# EAGLE schematic tottag (EAGLE 9.4.2)
AUTHOR: Andreas Biri; REV: F; TITLE: TotTag

## Sheet 1 of 4: nRF8240
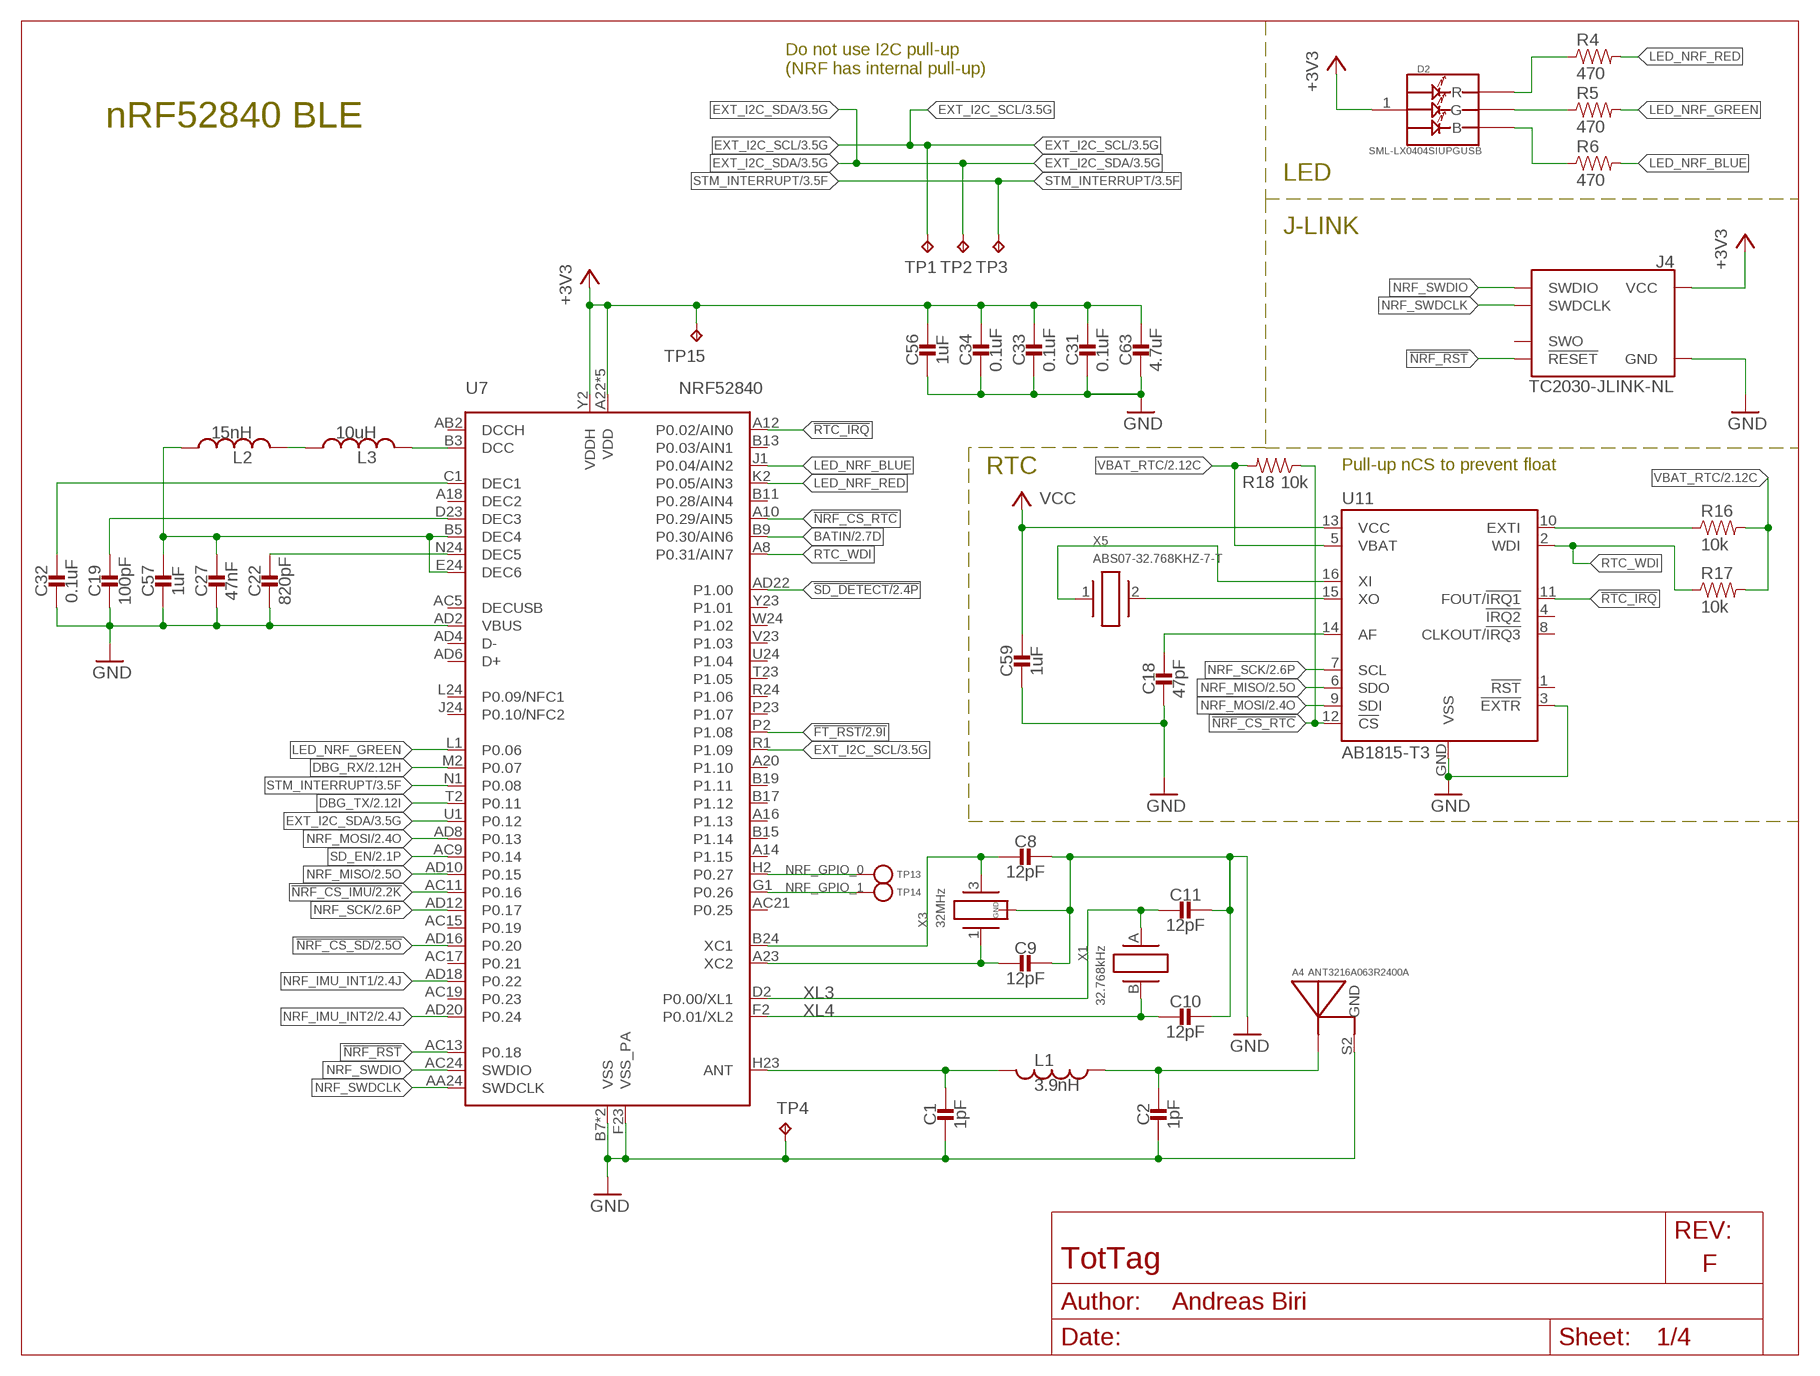
[diagram p0: schematic, sheet 1]

### Parts
A4  ANT3216A063R2400A  [ANT3216A063R2400A]
C1  1pF  CAPACITOR0402_CAP  [0402_CAP]
C2  1pF  CAPACITOR0402_CAP  [0402_CAP]
C8  12pF  CAPACITOR0402_CAP  [0402_CAP]
C9  12pF  CAPACITOR0402_CAP  [0402_CAP]
C10  12pF  CAPACITOR0402_CAP  [0402_CAP]
C11  12pF  CAPACITOR0402_CAP  [0402_CAP]
C18  47pF  CAPACITOR0402_CAP  [0402_CAP]
C19  100pF  CAPACITOR0402_CAP  [0402_CAP]
C22  820pF  CAPACITOR0402_CAP  [0402_CAP]
C27  47nF  CAPACITOR0402_CAP  [0402_CAP]
C31  0.1uF  CAPACITOR0402_CAP  [0402_CAP]
C32  0.1uF  CAPACITOR0402_CAP  [0402_CAP]
C33  0.1uF  CAPACITOR0402_CAP  [0402_CAP]
C34  0.1uF  CAPACITOR0402_CAP  [0402_CAP]
C56  1uF  CAPACITOR0402_CAP  [0402_CAP]
C57  1uF  CAPACITOR0402_CAP  [0402_CAP]
C59  1uF  CAPACITOR0402_CAP  [0402_CAP]
C63  4.7uF  CAPACITOR0402_CAP  [0402_CAP]
D2  SML-LX0404SIUPGUSB  [1MM_SQ_4PAD]
J4  TC2030-JLINK-NL  [TC2030-IDC-NL]
L1  3.9nH  INDUCTOR0402  [0402_CAP]
L2  15nH  INDUCTOR0402  [0402_CAP]
L3  10uH  INDUCTOR0603  [0603_CAP]
R4  470  RESISTOR0402_RES  [0402_RES]
R5  470  RESISTOR0402_RES  [0402_RES]
R6  470  RESISTOR0402_RES  [0402_RES]
R16  10k  RESISTOR0402_RES  [0402_RES]
R17  10k  RESISTOR0402_RES  [0402_RES]
R18  10k  RESISTOR0402_RES  [0402_RES]
TP1  TPTP06SQ  [TP06SQ]
TP2  TPTP06SQ  [TP06SQ]
TP3  TPTP06SQ  [TP06SQ]
TP4  TPTP06SQ  [TP06SQ]
TP13  TEST-POINT  [PAD.03X.03]
TP14  TEST-POINT  [PAD.03X.03]
TP15  TPTP06SQ  [TP06SQ]
U7  NRF52840  [AQFN73]
U11  AB1815-T3  [QFN-16-3MM]
X1  32.768kHz  ABS05-32.768KHZ-9-T  [ABS05]
X3  32MHz  7V-32.000MAHV-T  [TXC-7V]
X5  ABS07-32.768KHZ-7-T  [2-SMD]

### Nets
!FT_RST: U7.P2(P1.08) ; also sheet 2
!NRF_CS_IMU: U7.AC11(P0.16) ; also sheet 2
!NRF_CS_RTC: R18.1 U7.A10(P0.29/AIN5) U11.12(!CS)
!NRF_CS_SD: U7.AD16(P0.20) ; also sheet 2
!NRF_RST: J4.3(!RESET) U7.AC13(P0.18)
!RTC_IRQ: U7.A12(P0.02/AIN0) U11.11(FOUT/!IRQ1)
!SD_DETECT: U7.AD22(P1.00) ; also sheet 2
+3V3: C31.1 C33.1 C34.1 C56.1 C63.1 D2.1(VDD) J4.1(VCC) TP15.TP U7.A22(VDD) U7.AD14(VDD) U7.AD23(VDD) U7.B1(VDD) U7.W1(VDD) U7.Y2(VDDH) ; also sheet 2,3,4
BATIN: U7.B9(P0.30/AIN6) ; also sheet 2
DBG_RX: U7.M2(P0.07) ; also sheet 2
DBG_TX: U7.T2(P0.11) ; also sheet 2
EXT_I2C_SCL: TP1.TP U7.R1(P1.09) ; also sheet 3,4
EXT_I2C_SDA: TP2.TP U7.U1(P0.12) ; also sheet 3,4
GND: A4.S2(GND) C1.2 C2.2 C8.1 C9.1 C10.1 C11.1 C18.2 C19.2 C22.2 C27.2 C31.2 C32.2 C33.2 C34.2 C56.2 C57.2 C59.2 C63.2 J4.5(GND) TP4.TP U7.AD2(VBUS) U7.B7(VSS) U7.F23(VSS_PA) U7.GND(VSS) U11.3(!EXTR) U11.GND(VSS) X3.2(GND) X3.4(GND) ; also sheet 2,3
LED_NRF_BLUE: R6.2 U7.J1(P0.04/AIN2)
LED_NRF_GREEN: R5.2 U7.L1(P0.06)
LED_NRF_RED: R4.2 U7.K2(P0.05/AIN3)
N$2: C22.1 U7.N24(DEC5)
N$6: C32.1 U7.C1(DEC1)
N$9: C27.1 C57.1 L2.1 U7.B5(DEC4) U7.E24(DEC6)
N$10: C19.1 U7.D23(DEC3)
N$15: C1.1 L1.2 U7.H23(ANT)
N$17: A4.S1(ANTENNA) C2.1 L1.1
N$18: C8.2 U7.B24(XC1) X3.3
N$19: C9.2 U7.A23(XC2) X3.1
N$20: L3.2 U7.B3(DCC)
N$35: C18.1 U11.14(AF)
N$37: L2.2 L3.1
N$41: U11.16(XI) X5.1
N$42: U11.15(XO) X5.2
N$43: R16.1 U11.10(EXTI)
N$59: D2.2(R) R4.1
N$60: D2.4(G) R5.1
N$61: D2.3(B) R6.1
NRF_GPIO_0: TP13.P$1(TESTPOINT) U7.H2(P0.27)
NRF_GPIO_1: TP14.P$1(TESTPOINT) U7.G1(P0.26)
NRF_IMU_INT1: U7.AD18(P0.22) ; also sheet 2
NRF_IMU_INT2: U7.AD20(P0.24) ; also sheet 2
NRF_MISO: U7.AD10(P0.15) U11.6(SDO) ; also sheet 2
NRF_MOSI: U7.AD8(P0.13) U11.9(SDI) ; also sheet 2
NRF_SCK: U7.AD12(P0.17) U11.7(SCL) ; also sheet 2
NRF_SWDCLK: J4.4(SWDCLK) U7.AA24(SWDCLK)
NRF_SWDIO: J4.2(SWDIO) U7.AC24(SWDIO)
RTC_WDI: R17.1 U7.A8(P0.31/AIN7) U11.2(WDI)
SD_EN: U7.AC9(P0.14) ; also sheet 2
STM_INTERRUPT: TP3.TP U7.N1(P0.08) ; also sheet 3,4
VBAT_RTC: R16.2 R17.2 R18.2 U11.5(VBAT) ; also sheet 2
VCC: C59.1 U11.13(VCC)
XL3: C11.2 U7.D2(P0.00/XL1) X1.A
XL4: C10.2 U7.F2(P0.01/XL2) X1.B
Unconnected: J4.6(SWO) U7.A14(P1.15) U7.A16(P1.13) U7.A18(DEC2) U7.A20(P1.10) U7.AB2(DCCH) U7.AC5(DECUSB) U7.AC15(P0.19) U7.AC17(P0.21) U7.AC19(P0.23) U7.AC21(P0.25) U7.AD4(D-) U7.AD6(D+) U7.B11(P0.28/AIN4) U7.B13(P0.03/AIN1) U7.B15(P1.14) U7.B17(P1.12) U7.B19(P1.11) U7.J24(P0.10/NFC2) U7.L24(P0.09/NFC1) U7.P23(P1.07) U7.R24(P1.06) U7.T23(P1.05) U7.U24(P1.04) U7.V23(P1.03) U7.W24(P1.02) U7.Y23(P1.01) U11.1(!RST) U11.4(!IRQ2) U11.8(CLKOUT/!IRQ3)

### Notes on the sheet
- Do not use I2C pull-up
  (NRF has internal pull-up)
- nRF52840 BLE
- LED
- J-LINK
- RTC | Pull-up nCS to prevent float

## Sheet 2 of 4: Power + SD + Sensors
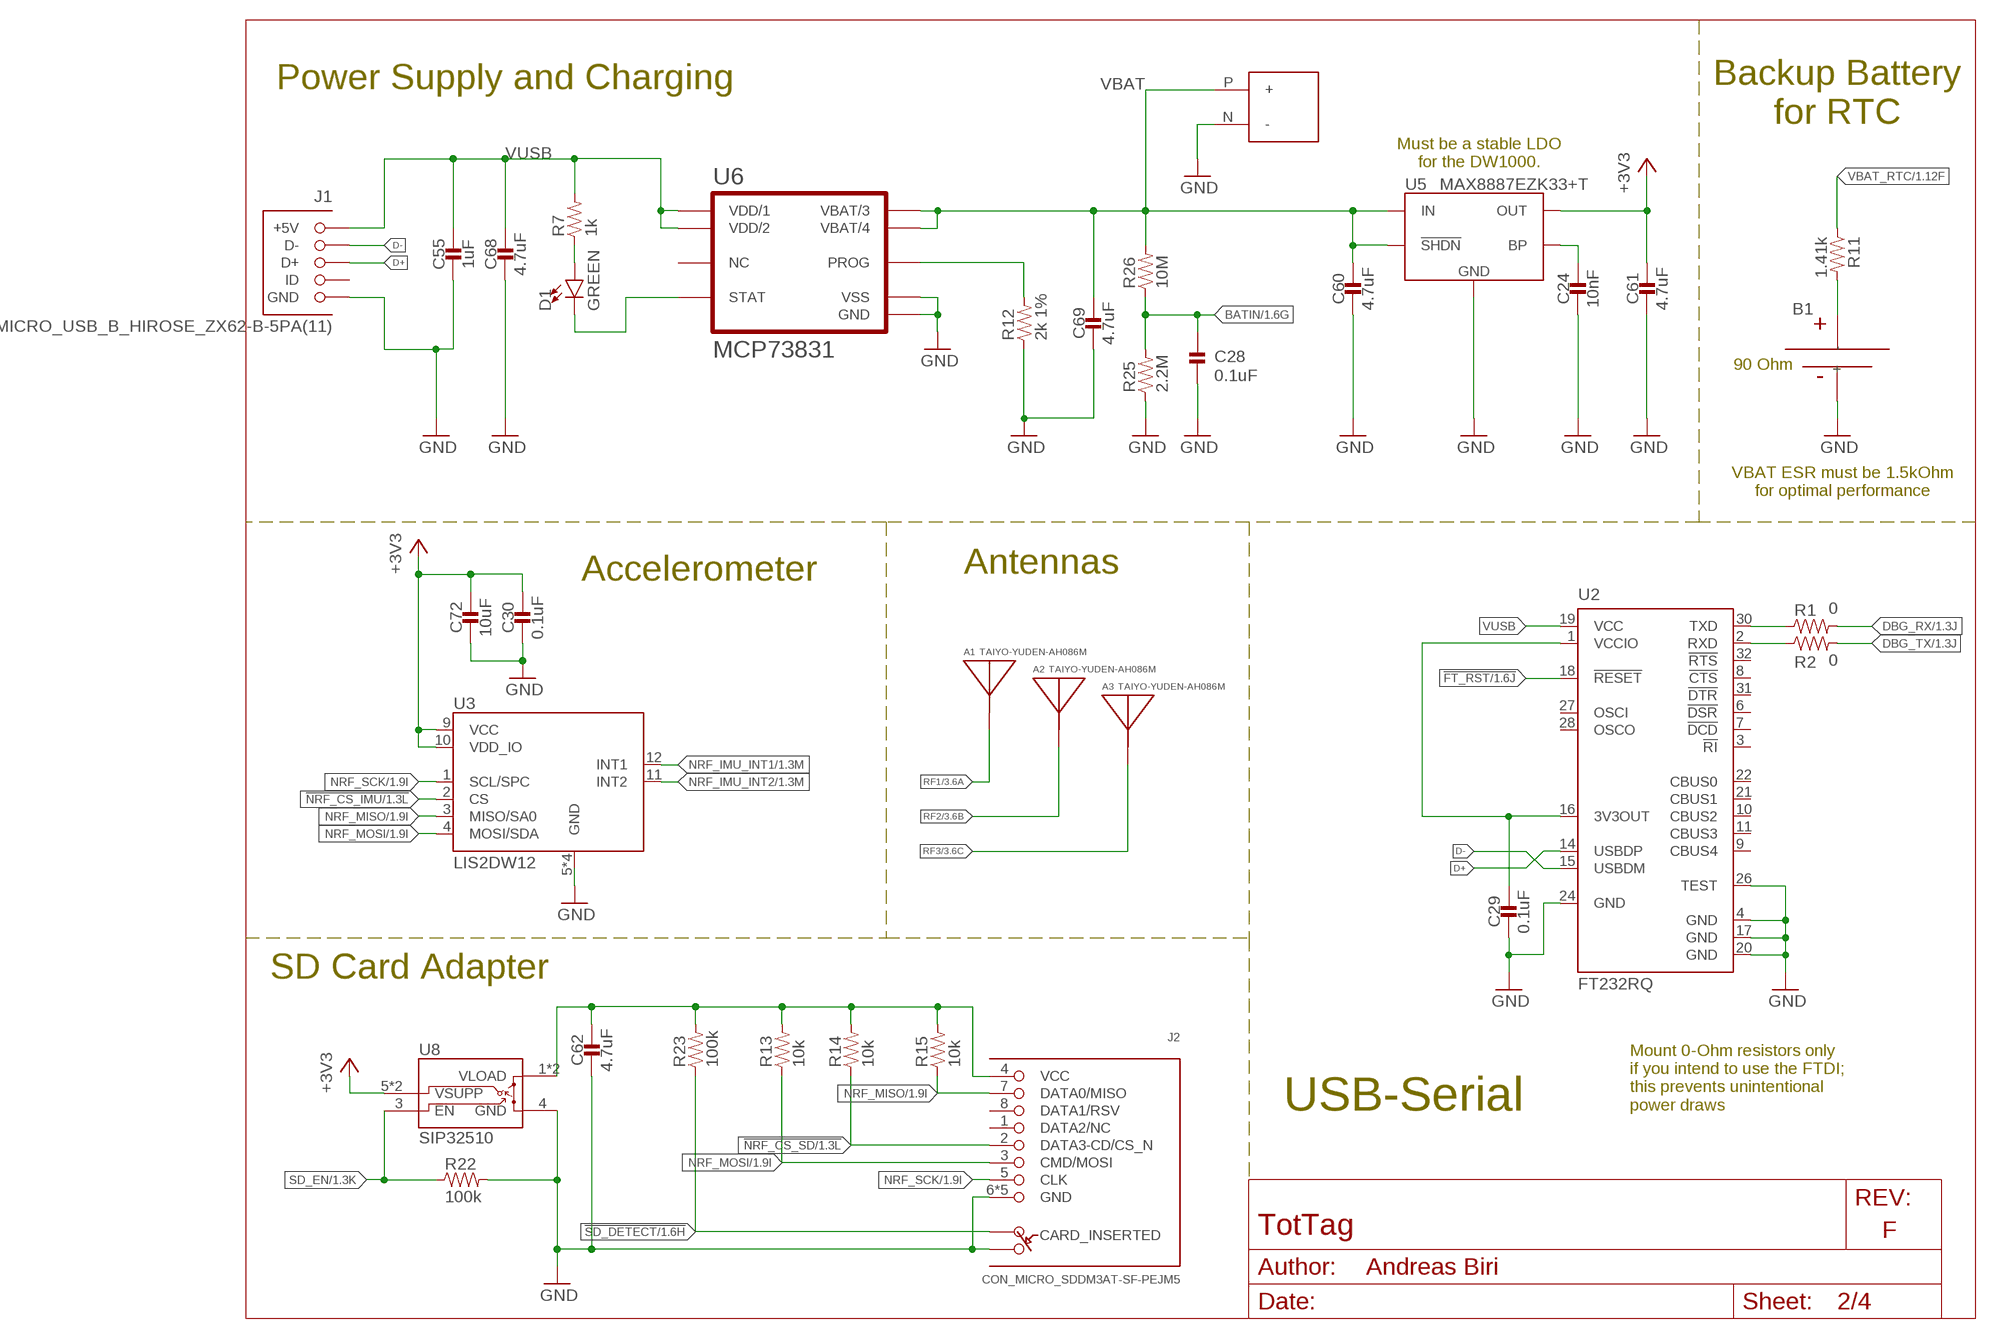
[diagram p1: schematic, sheet 2]

### Parts
A1  TAIYO-YUDEN-AH086M  [TAIYO-YUDEN-AH086M]
A2  TAIYO-YUDEN-AH086M  [TAIYO-YUDEN-AH086M]
A3  TAIYO-YUDEN-AH086M  [TAIYO-YUDEN-AH086M]
B1  MS518SE  [MS518SE-FL35E]
C24  10nF  CAPACITOR0402_CAP  [0402_CAP]
C28  0.1uF  CAPACITOR0402_CAP  [0402_CAP]
C29  0.1uF  CAPACITOR0402_CAP  [0402_CAP]
C30  0.1uF  CAPACITOR0402_CAP  [0402_CAP]
C55  1uF  CAPACITOR0402_CAP  [0402_CAP]
C60  4.7uF  CAPACITOR0402_CAP  [0402_CAP]
C61  4.7uF  CAPACITOR0402_CAP  [0402_CAP]
C62  4.7uF  CAPACITOR0402_CAP  [0402_CAP]
C68  4.7uF  CAPACITOR0402_CAP  [0402_CAP]
C69  4.7uF  CAPACITOR0402_CAP  [0402_CAP]
C72  10uF  CAPACITOR0603_CAP  [0603_CAP]
D1  GREEN  LED0603  [LED-0603]
J1  MICRO_USB_B_HIROSE_ZX62-B-5PA(11)  [USB_MICRO_B-HIROSE-ZX62-B-5PA(11)]
J2  CON_MICRO_SDDM3AT-SF-PEJM5  [DM3AT-SF-PEJM5]
J3  BAT_HOLE  [BATTERY_HOLE]
R1  0  RESISTOR0402_RES  [0402_RES]
R2  0  RESISTOR0402_RES  [0402_RES]
R7  1k  RESISTOR0402_RES  [0402_RES]
R11  1.41k  RESISTOR0402_RES  [0402_RES]
R12  2k 1%  RESISTOR0402_RES  [0402_RES]
R13  10k  RESISTOR0402_RES  [0402_RES]
R14  10k  RESISTOR0402_RES  [0402_RES]
R15  10k  RESISTOR0402_RES  [0402_RES]
R22  100k  RESISTOR0402_RES  [0402_RES]
R23  100k  RESISTOR0402_RES  [0402_RES]
R25  2.2M  RESISTOR0402_RES  [0402_RES]
R26  10M  RESISTOR0402_RES  [0402_RES]
U2  FT232RQ  [QFN32]
U3  LIS2DW12  [LGA-12]
U5  MAX8887EZK33+T  [SOT-23-5]
U6  MCP73831  [DFN-8-MCP]
U8  SIP32510  [TSOT23-6]

### Nets
!CHRG: D1.A R7.1
!FT_RST: U2.18(!RESET) ; also sheet 1
!NRF_CS_IMU: U3.2(CS) ; also sheet 1
!NRF_CS_SD: J2.2(DATA3-CD/CS_N) R14.1 ; also sheet 1
!SD_DETECT: J2.A R23.1 ; also sheet 1
+3V3: C30.1 C61.1 C72.1 U3.9(VCC) U3.10(VDD_IO) U5.5(OUT) U8.5(VSUPP) U8.6(VSUPP) ; also sheet 1,3,4
BATIN: C28.2 R25.2 R26.1 ; also sheet 1
D+: J1.3(D+) U2.14(USBDP)
D-: J1.2(D-) U2.15(USBDM)
DBG_RX: R1.2 ; also sheet 1
DBG_TX: R2.2 ; also sheet 1
GND: B1.- C24.2 C28.1 C29.2 C30.2 C55.2 C60.2 C61.2 C62.2 C68.2 C69.2 C72.2 J1.5(GND) J2.6(GND) J2.B J2.MOUNT0(GND) J2.MOUNT1(GND) J2.MOUNT2(GND) J2.MOUNT3(GND) J3.N(-) R12.1 R22.2 R25.1 U2.4(GND) U2.17(GND) U2.20(GND) U2.24(GND) U2.26(TEST) U3.5(GND) U3.6(GND) U3.7(GND) U3.8(GND) U5.2(GND) U6.6(VSS) U6.GND U8.4(GND) ; also sheet 1,3
N$1: C29.1 U2.1(VCCIO) U2.16(3V3OUT)
N$5: D1.C U6.5(STAT)
N$11: C24.1 U5.4(BP)
N$13: R12.2 U6.8(PROG)
N$33: R1.1 U2.30(TXD)
N$34: R2.1 U2.2(RXD)
N$45: B1.+ R11.2
N$55: C62.1 J2.4(VCC) R13.2 R14.2 R15.2 R23.2 U8.1(VLOAD) U8.2(VLOAD)
NRF_IMU_INT1: U3.12(INT1) ; also sheet 1
NRF_IMU_INT2: U3.11(INT2) ; also sheet 1
NRF_MISO: J2.7(DATA0/MISO) R15.1 U3.3(MISO/SA0) ; also sheet 1
NRF_MOSI: J2.3(CMD/MOSI) R13.1 U3.4(MOSI/SDA) ; also sheet 1
NRF_SCK: J2.5(CLK) U3.1(SCL/SPC) ; also sheet 1
RF1: A1.A(ANTENNA) ; also sheet 3,4
RF2: A2.A(ANTENNA) ; also sheet 3,4
RF3: A3.A(ANTENNA) ; also sheet 3,4
SD_EN: R22.1 U8.3(EN) ; also sheet 1
VBAT: C60.1 C69.1 J3.P(+) R26.2 U5.1(IN) U5.3(!SHDN) U6.3(VBAT/3) U6.4(VBAT/4)
VBAT_RTC: R11.1 ; also sheet 1
VUSB: C55.1 C68.1 J1.1(+5V) R7.2 U2.19(VCC) U6.1(VDD/1) U6.2(VDD/2)
Unconnected: J1.4(ID) J2.1(DATA2/NC) J2.8(DATA1/RSV) U2.3(!RI) U2.6(!DSR) U2.7(!DCD) U2.8(!CTS) U2.9(CBUS4) U2.10(CBUS2) U2.11(CBUS3) U2.21(CBUS1) U2.22(CBUS0) U2.27(OSCI) U2.28(OSCO) U2.31(!DTR) U2.32(!RTS) U6.7(NC)

### Notes on the sheet
- Power Supply and Charging
- Backup Battery
  for RTC
- Must be a stable LDO
  for the DW1000.
- 90 Ohm
- VBAT ESR must be 1.5kOhm
  for optimal performance
- Accelerometer | Antennas
- SD Card Adapter
- USB-Serial
- Mount 0-Ohm resistors only
  if you intend to use the FTDI;
  this prevents unintentional
  power draws

## Sheet 3 of 4: Localization module
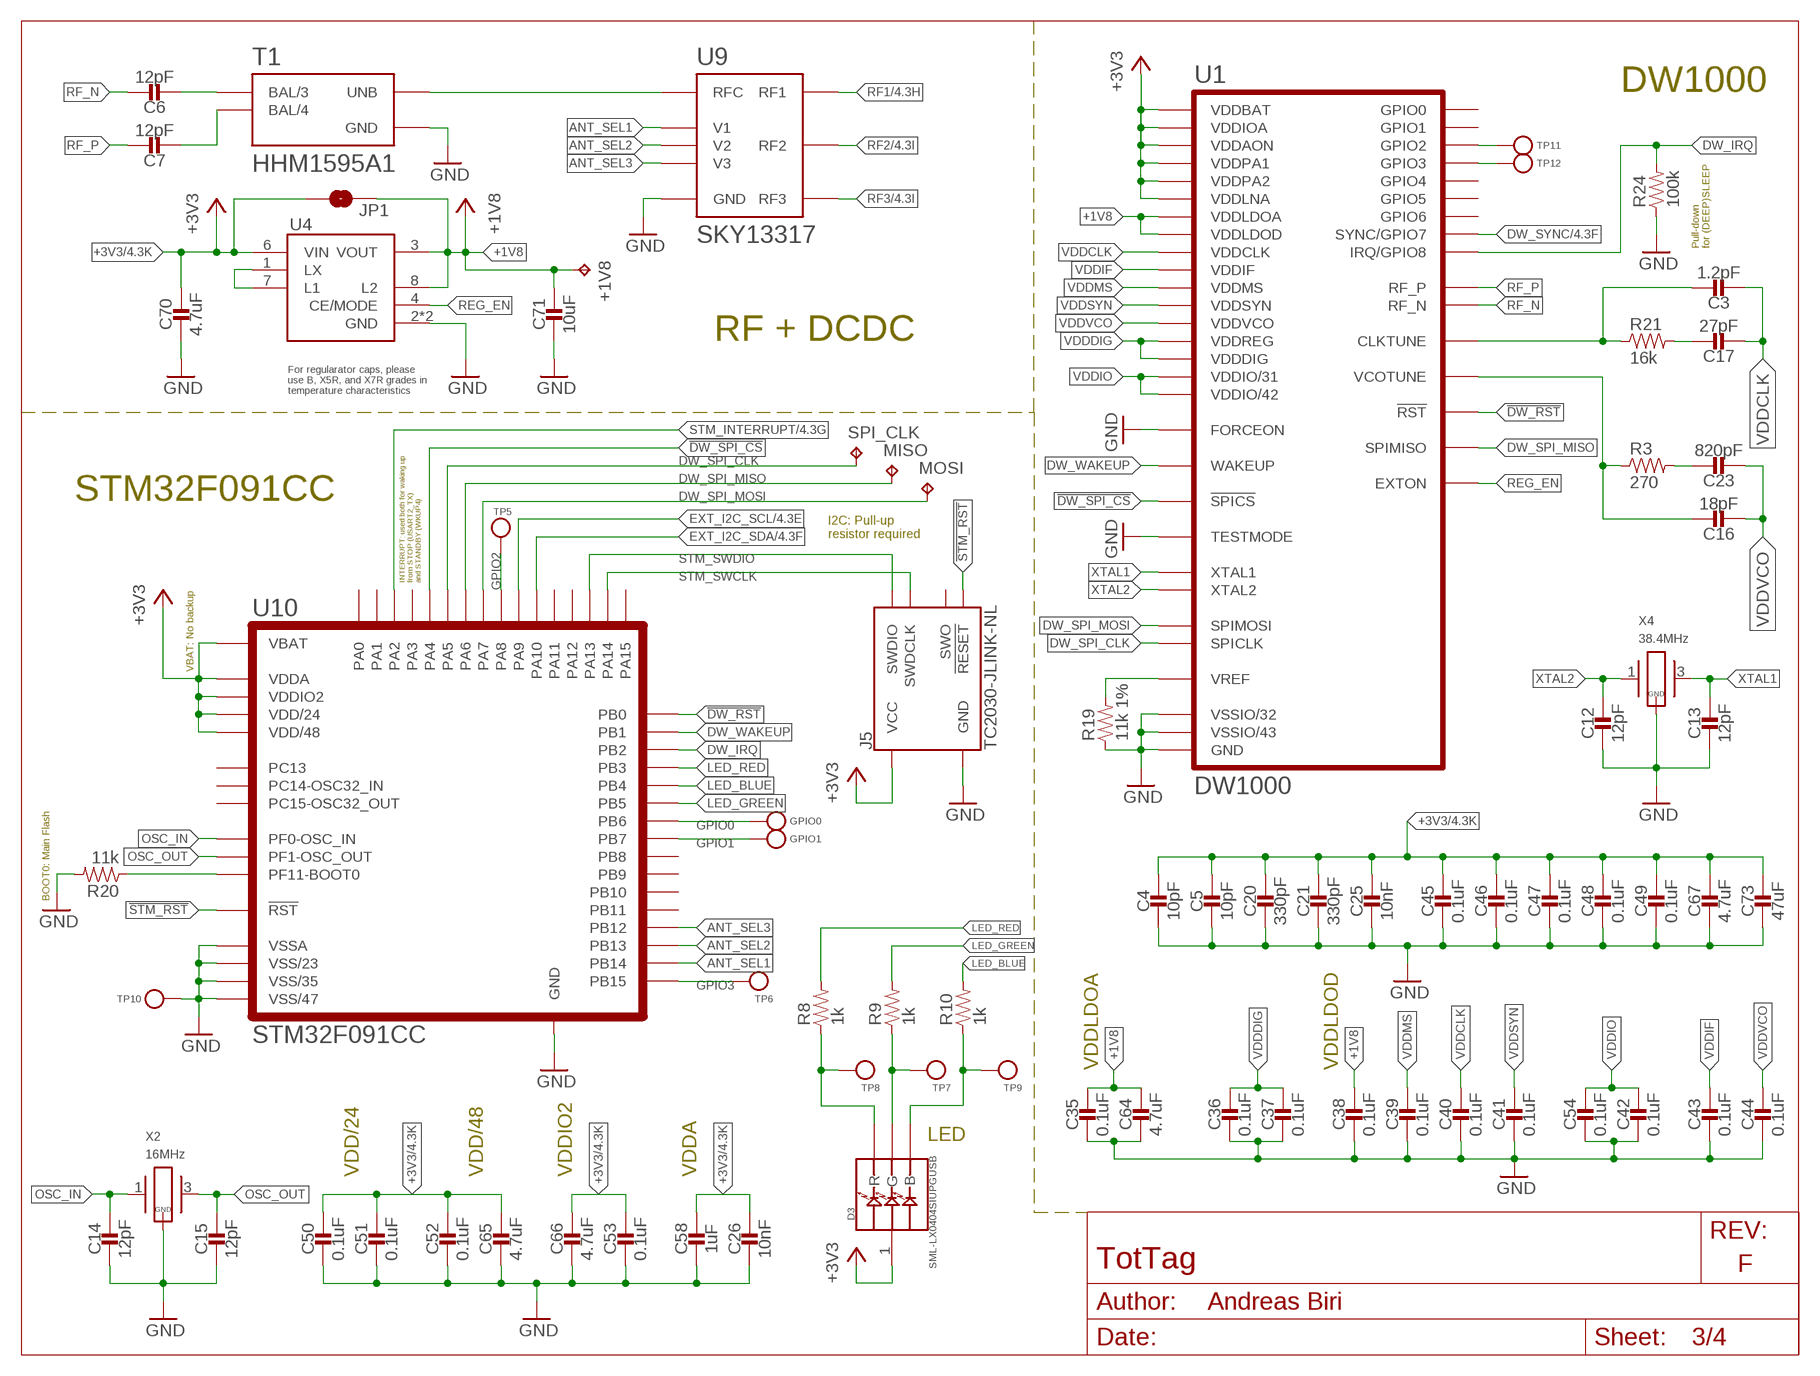
[diagram p2: schematic, sheet 3]

### Parts
+1V8  TPTP06SQ  [TP06SQ]
C3  1.2pF  CAPACITOR0402_CAP  [0402_CAP]
C4  10pF  CAPACITOR0402_CAP  [0402_CAP]
C5  10pF  CAPACITOR0402_CAP  [0402_CAP]
C6  12pF  CAPACITOR0201_CAP  [0201_CAP]
C7  12pF  CAPACITOR0201_CAP  [0201_CAP]
C12  12pF  CAPACITOR0402_CAP  [0402_CAP]
C13  12pF  CAPACITOR0402_CAP  [0402_CAP]
C14  12pF  CAPACITOR0402_CAP  [0402_CAP]
C15  12pF  CAPACITOR0402_CAP  [0402_CAP]
C16  18pF  CAPACITOR0402_CAP  [0402_CAP]
C17  27pF  CAPACITOR0402_CAP  [0402_CAP]
C20  330pF  CAPACITOR0402_CAP  [0402_CAP]
C21  330pF  CAPACITOR0402_CAP  [0402_CAP]
C23  820pF  CAPACITOR0402_CAP  [0402_CAP]
C25  10nF  CAPACITOR0402_CAP  [0402_CAP]
C26  10nF  CAPACITOR0402_CAP  [0402_CAP]
C35  0.1uF  CAPACITOR0402_CAP  [0402_CAP]
C36  0.1uF  CAPACITOR0402_CAP  [0402_CAP]
C37  0.1uF  CAPACITOR0402_CAP  [0402_CAP]
C38  0.1uF  CAPACITOR0402_CAP  [0402_CAP]
C39  0.1uF  CAPACITOR0402_CAP  [0402_CAP]
C40  0.1uF  CAPACITOR0402_CAP  [0402_CAP]
C41  0.1uF  CAPACITOR0402_CAP  [0402_CAP]
C42  0.1uF  CAPACITOR0402_CAP  [0402_CAP]
C43  0.1uF  CAPACITOR0402_CAP  [0402_CAP]
C44  0.1uF  CAPACITOR0402_CAP  [0402_CAP]
C45  0.1uF  CAPACITOR0402_CAP  [0402_CAP]
C46  0.1uF  CAPACITOR0402_CAP  [0402_CAP]
C47  0.1uF  CAPACITOR0402_CAP  [0402_CAP]
C48  0.1uF  CAPACITOR0402_CAP  [0402_CAP]
C49  0.1uF  CAPACITOR0402_CAP  [0402_CAP]
C50  0.1uF  CAPACITOR0402_CAP  [0402_CAP]
C51  0.1uF  CAPACITOR0402_CAP  [0402_CAP]
C52  0.1uF  CAPACITOR0402_CAP  [0402_CAP]
C53  0.1uF  CAPACITOR0402_CAP  [0402_CAP]
C54  0.1uF  CAPACITOR0402_CAP  [0402_CAP]
C58  1uF  CAPACITOR0402_CAP  [0402_CAP]
C64  4.7uF  CAPACITOR0402_CAP  [0402_CAP]
C65  4.7uF  CAPACITOR0402_CAP  [0402_CAP]
C66  4.7uF  CAPACITOR0402_CAP  [0402_CAP]
C67  4.7uF  CAPACITOR0402_CAP  [0402_CAP]
C70  4.7uF  CAPACITOR0402_CAP  [0402_CAP]
C71  10uF  CAPACITOR0402_CAP  [0402_CAP]
C73  47uF  CAPACITOR0603_CAP  [0603_CAP]
D3  SML-LX0404SIUPGUSB  [1MM_SQ_4PAD]
GPIO0  TEST-POINT  [PAD.03X.03]
GPIO1  TEST-POINT  [PAD.03X.03]
J5  TC2030-JLINK-NL  [TC2030-IDC-NL]
JP1  JUMPER-SMT_2_NO_NO-SILK  [SMT-JUMPER_2_NO_NO-SILK]
MISO  TPTP06SQ  [TP06SQ]
MOSI  TPTP06SQ  [TP06SQ]
R3  270  RESISTOR0402_RES  [0402_RES]
R8  1k  RESISTOR0402_RES  [0402_RES]
R9  1k  RESISTOR0402_RES  [0402_RES]
R10  1k  RESISTOR0402_RES  [0402_RES]
R19  11k 1%  RESISTOR0402_RES  [0402_RES]
R20  11k  RESISTOR0402_RES  [0402_RES]
R21  16k  RESISTOR0402_RES  [0402_RES]
R24  100k  RESISTOR0402_RES  [0402_RES]
SPI_CLK  TPTP06SQ  [TP06SQ]
T1  HHM1595A1  [EIA-0805]
TP5  TEST-POINT  [PAD.03X.03]
TP6  TEST-POINT  [PAD.03X.03]
TP7  TEST-POINT  [PAD.03X.03]
TP8  TEST-POINT  [PAD.03X.03]
TP9  TEST-POINT  [PAD.03X.03]
TP10  TEST-POINT  [PAD.03X.03]
TP11  TEST-POINT  [PAD.03X.03]
TP12  TEST-POINT  [PAD.03X.03]
U1  DW1000  [QFN-48-DW1000]
U4  XCL206B  [XCL20X]
U9  SKY13317  [MLPQ-UT-8]
U10  STM32F091CC  [UFQFPN-48]
X2  16MHz  FA-20H  [FA-20H]
X4  38.4MHz  FA-20H  [FA-20H]

### Nets
!DW_RST: U1.27(!RST) U10.18(PB0)
!DW_SPI_CS: U1.24(!SPICS) U10.14(PA4)
!STM_RST: J5.3(!RESET) U10.7(!RST)
+1V8: +1V8.TP C35.1 C38.1 C64.1 C71.1 JP1.2 U1.26(VDDLDOD) U1.48(VDDLDOA) U4.3(VOUT) U4.8(L2)
+3V3: C4.1 C5.1 C20.1 C21.1 C25.1 C26.1 C45.1 C46.1 C47.1 C48.1 C49.1 C50.1 C51.1 C52.1 C53.1 C58.1 C65.1 C66.1 C67.1 C70.1 C73.1 D3.1(VDD) J5.1(VCC) JP1.1 U1.15(VDDLNA) U1.18(VDDPA1) U1.19(VDDPA2) U1.25(VDDAON) U1.28(VDDIOA) U1.47(VDDBAT) U4.6(VIN) U10.1(VBAT) U10.9(VDDA) U10.24(VDD/24) U10.36(VDDIO2) U10.48(VDD/48) ; also sheet 1,2,4
ANT_SEL1: U9.3(V1) U10.27(PB14)
ANT_SEL2: U9.6(V2) U10.26(PB13)
ANT_SEL3: U9.7(V3) U10.25(PB12)
DW_IRQ: R24.2 U1.45(IRQ/GPIO8) U10.20(PB2)
DW_SPI_CLK: SPI_CLK.TP U1.41(SPICLK) U10.15(PA5)
DW_SPI_MISO: MISO.TP U1.40(SPIMISO) U10.16(PA6)
DW_SPI_MOSI: MOSI.TP U1.39(SPIMOSI) U10.17(PA7)
DW_SYNC: U1.29(SYNC/GPIO7) ; also sheet 4
DW_WAKEUP: U1.23(WAKEUP) U10.19(PB1)
EXT_I2C_SCL: U10.30(PA9) ; also sheet 1,4
EXT_I2C_SDA: U10.31(PA10) ; also sheet 1,4
GND: C4.2 C5.2 C12.2 C13.2 C14.2 C15.2 C20.2 C21.2 C25.2 C26.2 C35.2 C36.2 C37.2 C38.2 C39.2 C40.2 C41.2 C42.2 C43.2 C44.2 C45.2 C46.2 C47.2 C48.2 C49.2 C50.2 C51.2 C52.2 C53.2 C54.2 C58.2 C64.2 C65.2 C66.2 C67.2 C70.2 C71.2 C73.2 J5.5(GND) R19.1 R20.2 R24.1 T1.2(GND) T1.5(GND) TP10.P$1(TESTPOINT) U1.22(FORCEON) U1.32(VSSIO/32) U1.43(VSSIO/43) U1.46(TESTMODE) U1.GND U4.2(GND) U4.5(GND) U9.GND U10.8(VSSA) U10.23(VSS/23) U10.35(VSS/35) U10.47(VSS/47) U10.GND X2.2(GND) X2.4(GND) X4.2(GND) X4.4(GND) ; also sheet 1,2
GPIO0: GPIO0.P$1(TESTPOINT) U10.42(PB6)
GPIO1: GPIO1.P$1(TESTPOINT) U10.43(PB7)
GPIO2: TP5.P$1(TESTPOINT) U10.29(PA8)
GPIO3: TP6.P$1(TESTPOINT) U10.28(PB15)
LED_BLUE: R10.2 U10.40(PB4)
LED_GREEN: R9.2 U10.41(PB5)
LED_RED: R8.2 U10.39(PB3)
N$3: T1.1(UNB) U9.1(RFC)
N$4: C6.P$2 T1.3(BAL/3)
N$7: C7.P$2 T1.4(BAL/4)
N$8: C23.1 R3.2
N$12: C17.1 R21.2
N$14: C16.1 R3.1 U1.12(VCOTUNE)
N$16: C3.1 R21.1 U1.8(CLKTUNE)
N$21: R19.2 U1.5(VREF)
N$22: R20.1 U10.44(PF11-BOOT0)
N$23: D3.4(G) R9.1 TP7.P$1(TESTPOINT)
N$24: D3.3(B) R10.1 TP9.P$1(TESTPOINT)
N$25: D3.2(R) R8.1 TP8.P$1(TESTPOINT)
N$26: TP11.P$1(TESTPOINT) U1.36(GPIO2)
N$27: TP12.P$1(TESTPOINT) U1.35(GPIO3)
N$44: U4.1(LX) U4.7(L1)
OSC_IN: C14.1 U10.5(PF0-OSC_IN) X2.1
OSC_OUT: C15.1 U10.6(PF1-OSC_OUT) X2.3
REG_EN: U1.21(EXTON) U4.4(CE/MODE)
RF1: U9.4(RF1) ; also sheet 2,4
RF2: U9.5(RF2) ; also sheet 2,4
RF3: U9.8(RF3) ; also sheet 2,4
RF_N: C6.P$1 U1.17(RF_N)
RF_P: C7.P$1 U1.16(RF_P)
STM_INTERRUPT: U10.12(PA2) ; also sheet 1,4
STM_SWCLK: J5.4(SWDCLK) U10.37(PA14)
STM_SWDIO: J5.2(SWDIO) U10.34(PA13)
VDDCLK: C3.2 C17.2 C40.1 U1.9(VDDCLK)
VDDDIG: C36.1 C37.1 U1.20(VDDREG) U1.44(VDDDIG)
VDDIF: C43.1 U1.7(VDDIF)
VDDIO: C42.1 C54.1 U1.31(VDDIO/31) U1.42(VDDIO/42)
VDDMS: C39.1 U1.6(VDDMS)
VDDSYN: C41.1 U1.10(VDDSYN)
VDDVCO: C16.2 C23.2 C44.1 U1.11(VDDVCO)
XTAL1: C13.1 U1.3(XTAL1) X4.3
XTAL2: C12.1 U1.4(XTAL2) X4.1
Unconnected: J5.6(SWO) U1.30(GPIO6) U1.33(GPIO5) U1.34(GPIO4) U1.37(GPIO1) U1.38(GPIO0) U10.2(PC13) U10.3(PC14-OSC32_IN) U10.4(PC15-OSC32_OUT) U10.10(PA0) U10.11(PA1) U10.13(PA3) U10.21(PB10) U10.22(PB11) U10.32(PA11) U10.33(PA12) U10.38(PA15) U10.45(PB8) U10.46(PB9)

### Notes on the sheet
- DW1000
- Pull-down
  for (DEEP)SLEEP
- RF + DCDC
- For regularator caps, please
  use B, X5R, and X7R grades in
  temperature characteristics
- STM32F091CC
- I2C: Pull-up
  resistor required
- INTERRUPT: used both for waking up
  from STOP (USART2_TX)
  and STANDBY (WKUP4)
- VBAT: No backup
- BOOT0: Main Flash
- VDDLDOA | VDDLDOD
- LED
- VDD/24 | VDD/48 | VDDIO2 | VDDA

## Sheet 4 of 4: External signals
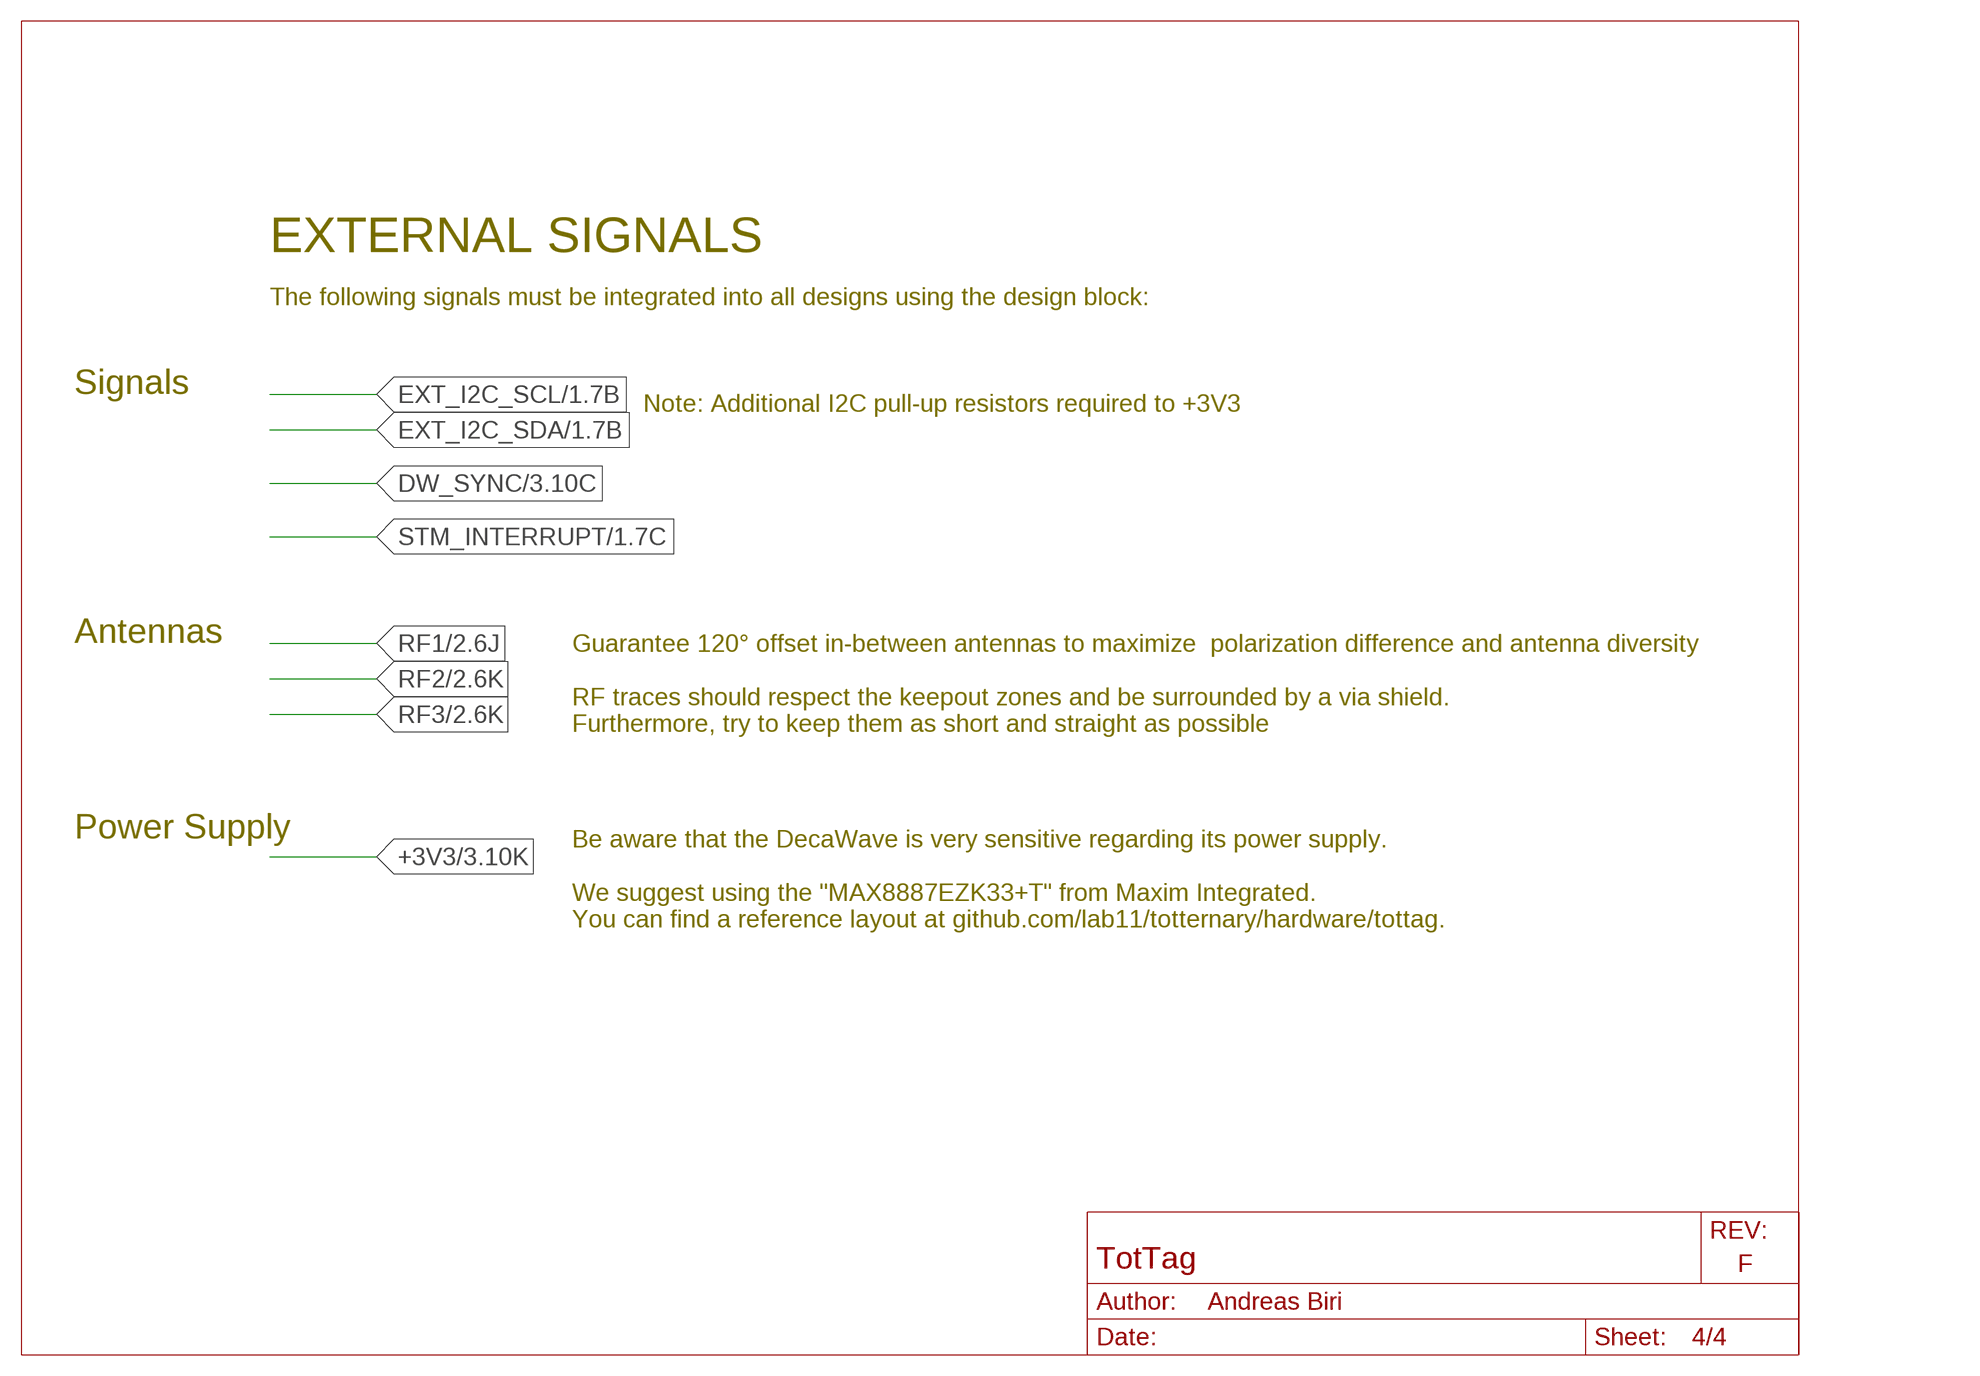
[diagram p3: schematic, sheet 4]

### Notes on the sheet
- EXTERNAL SIGNALS
- The following signals must be integrated into all designs using the design block:
- Signals
- Note: Additional I2C pull-up resistors required to +3V3
- Antennas
- Guarantee 120° offset in-between antennas to maximize  polarization difference and antenna diversity
  
  RF traces should respect the keepout zones and be surrounded by a via shield. 
  Furthermore, try to keep them as short and straight as possible
- Power Supply
- Be aware that the DecaWave is very sensitive regarding its power supply.
  
  We suggest using the "MAX8887EZK33+T" from Maxim Integrated.
  You can find a reference layout at github.com/lab11/totternary/hardware/tottag.

## Library data of the parts
+1V8 MISO MOSI SPI_CLK TP1-TP4 TP15 = testpad:TP: Test pad
A1-A3 = chips:TAIYO-YUDEN-AH086M: UWB Antenna - 3.1-8GHz; DIGIKEY: 587-2204-1-ND
A4 = chips:ANT3216A063R2400A: Yageo 2.4GHz WiFi/Bluetooth/Zigbee/ISM Chip Antenna; DIGIKEY: 311-1542-1-ND; MANUFACTURER: YAGEO; MPN: ANT3216A063R2400A
B1 = batteries:MS518SE: A small, low leakage rechargeable battery for RTC backup; DIGIKEY: 728-1054-ND; MANUFACTURER: Seiko; MPN: MS518SE-FL35E
C1 C2 = passives:CAPACITOR: SMD Capacitor; DIGIKEY: 490-3083-1-ND; MPN: GJM1555C1H1R0CB01D
C3-C7 C12-C17 C20 C21 C23-C26 C28 C34-C56 C58 C60 C61 C63-C71 C73 = passives:CAPACITOR: SMD Capacitor
C8-C11 = passives:CAPACITOR: SMD Capacitor; DIGIKEY: 490-6197-1-ND; MPN: GRM1555C1H120GA01D
C18 = passives:CAPACITOR: SMD Capacitor; DIGIKEY: 490-5942-1-ND; MPN: GRM1555C1H470JA01D
C19 = passives:CAPACITOR: SMD Capacitor; DIGIKEY: 490-5922-1-ND; MPN: GRM1555C1H101JA01D
C22 = passives:CAPACITOR: SMD Capacitor; DIGIKEY: 1276-6989-1-ND; MPN: CL05C821JB5NFNC
C27 = passives:CAPACITOR: SMD Capacitor; DIGIKEY: 445-1264-1-ND; MPN: C1005X7R1C473K050BC
C29-C33 = passives:CAPACITOR: SMD Capacitor; DIGIKEY: 490-6328-1-ND; MPN: GRM155R71C104KA88J
C57 C59 = passives:CAPACITOR: SMD Capacitor; DIGIKEY: 490-7195-1-ND; MPN: GRM155R70G105KA12D
C62 = passives:CAPACITOR: SMD Capacitor; DESCRIPTION: CAP CER 4.7UF 6.3V X5R 0402; DIGIKEY: 445-5947-1-ND; MANUFACTURER: TDK; MPN: C1005X5R0J475K050BC
C72 = passives:CAPACITOR: SMD Capacitor; DIGIKEY: 490-3896-1-ND; MPN: GRM188R60J106ME47D
D1 = SparkFun-LED:LED: LED (Generic) Standard schematic elements and footprints for 5mm, 3mm, 1206, and 0603 sized LEDs. Generic LEDs with no color specified.
D2 D3 = leds:SML-LX0404SIUPGUSB: 1mm^2 RGB LED; DIGIKEY: 67-2125-1-ND; MANUFACTURER: Lumex Opto; MPN: SML-LX0404SIUPGUSB
GPIO0 GPIO1 TP5-TP14 = headers:TEST-POINT
J1 = connector:MICRO_USB_B_HIROSE_ZX62-B-5PA(11): Connector Receptacle USB - micro B 2.0 5 Position Surface Mount, Right Angle, Horizontal Bottom Mount; DIGIKEY: H11634CT-ND; MOUSER: 798-ZX62-B-5PA11; NEWARK: 86P8793
J2 = connector:CON_MICRO_SD: CONN MICRO SD R/A PUSH-PUSH SMD; DIGIKEY: HR1964CT-ND
J3 = connector:BAT_HOLE
J4 J5 = connector:TC2030-JLINK
JP1 = SparkFun-Jumpers:JUMPER-SMT_2_NO: Normally open jumper This jumper has two pads in close proximity to each other. Apply solder to close the connection. Round pads are easier to solder for beginners, but are a lot larger. SparkFun Product that uses the round pads: SparkFun EL Sequencer <https://www.sparkfun.com/products/12781>
L1 = passives:INDUCTOR: A very specific inductor; DIGIKEY: AISC-0402-3N9G-TCT-ND; MPN: AISC-0402-3N9G-T
L2 = passives:INDUCTOR: A very specific inductor; DIGIKEY: 587-1521-1-ND; MPN: HK100515NJ-T
L3 = passives:INDUCTOR: A very specific inductor; DIGIKEY: 490-4025-1-ND; MPN: LQM18FN100M00D
R1-R10 R12-R15 R19-R26 = passives:RESISTOR: Resistor Basic schematic elements and footprints for 0201, 0402, 0603, 1206, and PTH resistors.
R11 R16-R18 = passives:RESISTOR: Resistor Basic schematic elements and footprints for 0201, 0402, 0603, 1206, and PTH resistors.; DIGIKEY: 311-10KJRCT-ND; MPN: RC0402JR-0710KL
T1 = rf:HHM1595A1: Description: Symbol for HHM1595A1 <https://product.tdk.com/info/en/documents/data_sheet/rf_balun_hhm1595a1_en.pdf>, a multilayer Balun from TDK.; DATASHEET: https://product.tdk.com/info/en/documents/data_sheet/rf_balun_hhm1595a1_en.pdf; DESCRIPTION: XFMR BALUN RF 3.0-8.0GHZ UWB SMD; DIGIKEY: 445-3387-1-ND; MANUFACTURER: TDK Corporation; MOUSER: 810-HHM1595A1; MPN: HHM1595A1
U1 = chips:DW1000: Description: The DecaWave DW1000 <https://www.decawave.com/sites/default/files/resources/dw1000-datasheet-v2.13.pdf> chip, used for UWB two-way ranging.; DATASHEET: https://www.decawave.com/sites/default/files/resources/dw1000-datasheet-v2.13.pdf; DESCRIPTION: IC RF TXRX 802.15.4 48-QFN; DIGIKEY: 1479-1001-1-ND; MANUFACTURER: Decawave Limited; MPN: DW1000-I-TR13
U2 = ftdichip:FT232R: Source: http://www.ftdichip.com/Documents/DataSheets/DS_FT232R_v104.pdf; MPN: FT232RQ; OC_FARNELL: 1146033; OC_NEWARK: 91K9919
U3 = chips:LIS2DW12: ultra low power 3 axis accelerometer; DIGIKEY: 497-17718-6-ND; MANUFACTURER: STMicroelectronics; MOUSER: 511-LIS2DW12TR; MPN: LIS2DW12TR
U4 = regulators:XCL206: Non-Isolated PoL Module DC DC Converter 1 Output 1.8V 600mA 2V - 6V Input; DIGIKEY: 893-1406-2-ND; MPN: XCL206B183CR-G
U5 = chips:MAX8887: IC REG LDO 3.3V 0.3A TSOT23-5; DIGIKEY: MAX8887EZK33+TCT-ND
U6 = chips:MCP73831: Description: Device for MCP73831 <https://www.microchip.com/wwwproducts/en/MCP73831>, a battery charge controller from Microchip.; DATASHEET: http://ww1.microchip.com/downloads/en/DeviceDoc/20001984g.pdf; DESCRIPTION: IC CONTROLLER LI-ION 4.2V 8DFN; DIGIKEY: MCP73831T-2ACI/MCCT-ND; MANUFACTURER: Microchip Technology; MOUSER: 579-MCP73832T-2ACIMC; MPN: MCP73831T-2ACI/MC
U7 = chips:NRF52840: ultra-low power 2.4 GHz wireless system on chip (SoC) integrating a multiprotocol 2.4 GHz transceiver, an ARM® Cortex®-M4F CPU.; DIGIKEY: 1490-1071-1-ND; MANUFACTURER: NORIDIC SEMICONDUCTOR; MPN: NRF52840
U8 = chips:SIP32510: Load switch, slew rate controlled. By Vishay; DIGIKEY: SIP32510DT-T1-GE3CT-ND; MANUFACTURER: Vishay; MPN: SIP32510DT-T1-GE3
U9 = switches:SKY13317: Description: Device for SKY13317-373LF <http://www.skyworksinc.com/uploads/documents/SKY13317_373LF_200914K.pdf>, an RF switch from Skyworks Inc.; DATASHEET: http://www.skyworksinc.com/uploads/documents/SKY13317_373LF_200914K.pdf; DESCRIPTION: IC SWITCH RF SP3T 8-MLP; DIGIKEY: 863-1056-1-ND; MANUFACTURER: Skyworks Solutions Inc.; MPN: SKY13317-373LF
U10 = chips:STM32F091CC: Description: STM32F091CC <https://www.st.com/resource/en/datasheet/stm32f091cc.pdf> from STMicroelectronics, an ARM-based 32-bit MCU with 256 kB Flash, 32kB of SRAM and a Cortex M0; DATASHEET: https://www.st.com/resource/en/datasheet/stm32f091cc.pdf; DESCRIPTION: IC MCU 32BIT 256KB FLASH 48QFPN; DIGIKEY: 497-15813-ND; MANUFACTURER: STMicroelectronics; MOUSER: 511-STM32F091CCU6; MPN: STM32F091CCU6
U11 = chips:AB1815-T3: Ultra-low current RTC. 55nA quiescent @ 3V. 1.5-3.6V input.; DIGIKEY: 535-11936-1-ND; MANUFACTURER: Abracon; MPN: AB1815-T3
X1 = crystals:ABS05-32.768KHZ: 32.768kHz Crystal; DIGIKEY: 535-11897-1-ND; MANUFACTURER: Abracon; MPN: ABS05-32.768KHZ-9-T
X2 = crystals:FA-20H: Description: Oscillator by EPSON from 12MHz to 54 MHz; DATASHEET: https://support.epson.biz/td/api/doc_check.php?dl=brief_FA-20H_en.pdf; DESCRIPTION: 16MHz ±10ppm Crystal 8pF 80 Ohms 4-SMD, No Lead; DIGIKEY: SER3913CT-ND; MANUFACTURER: EPSON
X3 = crystals:7V: TXC CRYSTAL SMD; DIGIKEY: 887-2568-1-ND; MANUFACTURER: TXC CORPORATION; MPN: 7M-32.000MAHV-T
X4 = crystals:FA-20H: Description: Oscillator by EPSON from 12MHz to 54 MHz; DATASHEET: https://support.epson.biz/td/api/doc_check.php?dl=brief_FA-20H_en.pdf; DESCRIPTION: 38.4MHz ±10ppm Crystal 8.5pF 40 Ohms 4-SMD, No Lead; DIGIKEY: SER3631CT-ND; MANUFACTURER: EPSON
X5 = crystals:ABS07-32.768KHZ: 32.768kHz Crystal; DIGIKEY: 535-9543-1-ND; MANUFACTURER: ABRACON; MPN: ABS07-32.768KHZ-7-T